# Altium schematic sheet 41. FPC Camera.SchDoc: CSI FPC CAMERA CONNECTORS
size 513 x 386 mm; Project: PROC154E2(001)_SK_AM69; Issue: 1.0; RevCode: E3; Page Create Date: March  8, 1995; Variant Name: Core Design; Schematic Page Number: 41; Page Number: 41; Page Size: C; Comment: MISTRAL_TITLEBLK_CSIZE_1; Page Count: 62; Schematic Page Count: 62; Name: PROC154E2 001 SK AM69; DsnPath: C:\Users\danie\Downloads\sprr466c\PROC154E3_RP\PROC154E3_SCH.DSN; SchematicName: SCHEMATIC1; PageName: 41. FPC Camera; PageSize: C; TopSchematic: True
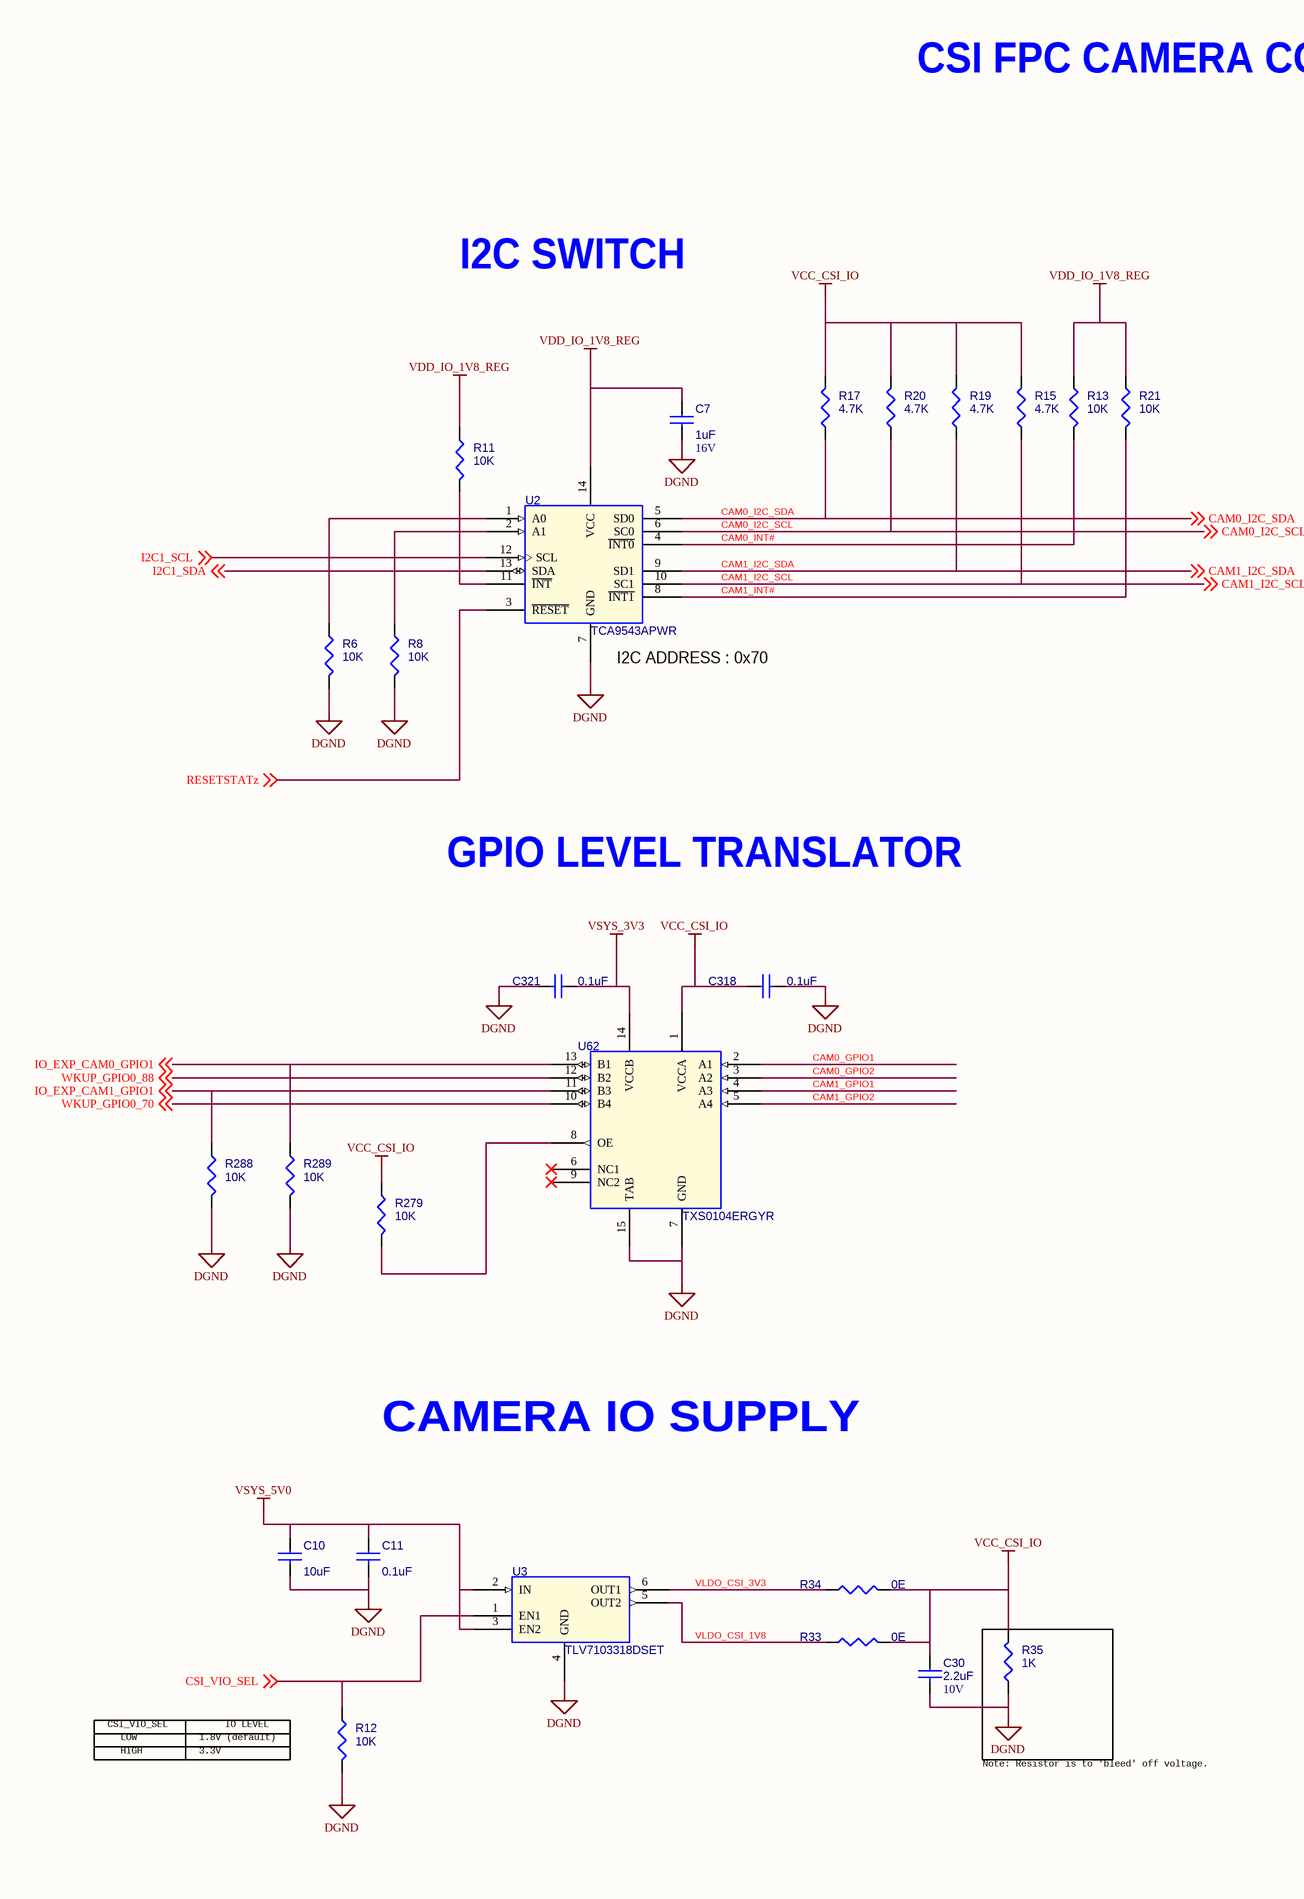
[diagram p0: 41. FPC Camera.SchDoc, left]
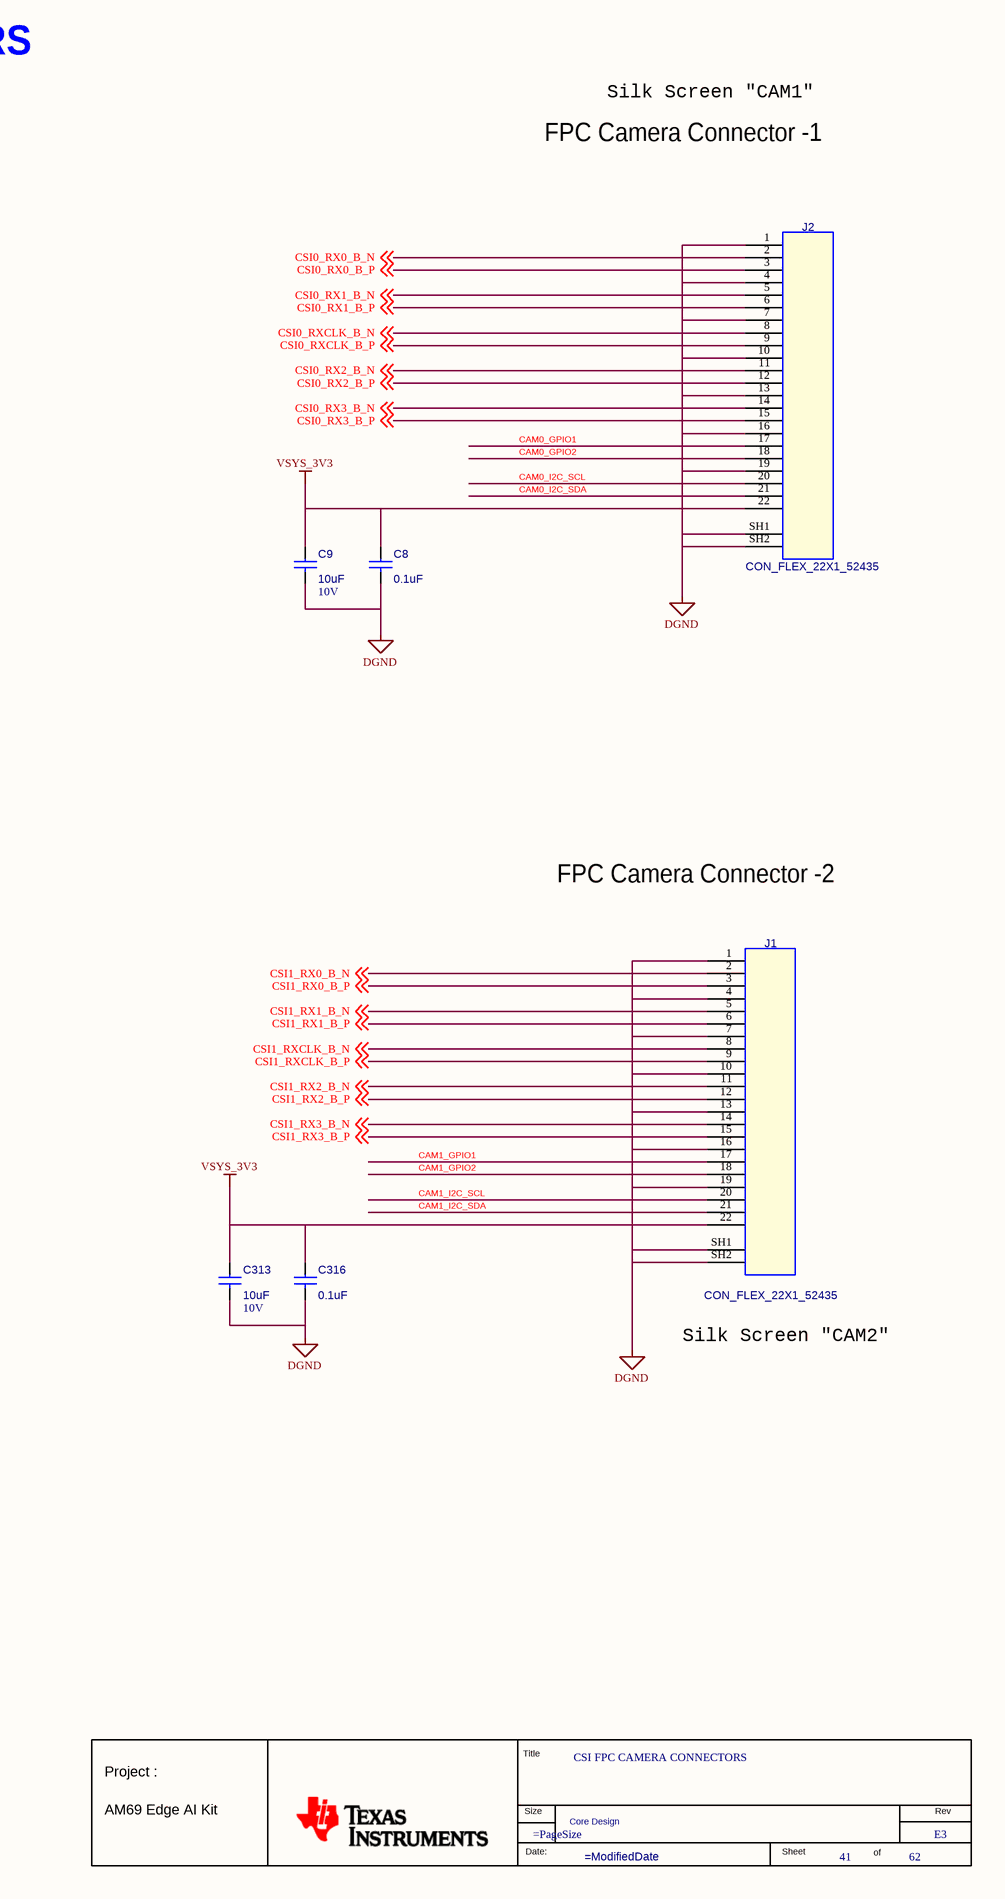
[diagram p1: 41. FPC Camera.SchDoc, right]

## Parts
*  RevCode: E3  Title: CSI FPC CAMERA CONNECTORS  Page Number: 41  Page Count: 62  Variant Name: Core Design  (hidden comment: MISTRAL_TITLEBLK_CSIZE_1)  (graphical)
C7  1uF  Voltage: 16V  [CAP0201_0-5]
C8  0.1uF  [CAP0201_0-5]
C9  10uF  Voltage: 10V  [CAP0402_1]
C10  10uF  [CAP0603_1]
C11  0.1uF  [CAP0201_0-5]
C30  2.2uF  Voltage: 10V  [CAP0603_1]
C313  10uF  Voltage: 10V  [CAP0402_1]
C316  0.1uF  [CAP0201_0-5]
C318  0.1uF  [CAP0201_0-5]
C321  0.1uF  [CAP0201_0-5]
J1  CON_FLEX_22X1_52435  [CON_FLEX22X1_52435_S_R_S]
J2  CON_FLEX_22X1_52435  [CON_FLEX22X1_52435_S_R_S]
R6  10K  [RES0201_0-5]
R8  10K  [RES0201_0-5]
R11  10K  [RES0201_0-5]
R12  10K  [RES0201_0-5]
R13  10K  [RES0201_0-5]
R15  4.7K  [RES0201_0-5]
R17  4.7K  [RES0201_0-5]
R19  4.7K  [RES0201_0-5]
R20  4.7K  [RES0201_0-5]
R21  10K  [RES0201_0-5]
R33  0E  [RES0402_0-5]
R34  0E  [RES0402_0-5]
R35  1K  [RES0201_0-5]
R279  10K  [RES0201_0-5]
R288  10K  [RES0201_0-5]
R289  10K  [RES0201_0-5]
U2  TCA9543APWR  [TSSOP14_25-59_205X180]
U3  TLV7103318DSET  [WSON6_19-68_60X60]
U62  TXS0104ERGYR  [QFN14_19-68_145X145]

## Nets
DGND: C7.2 C8.2 C9.2 C10.2 C11.2 C30.2 C313.2 C316.2 C318.2 C321.2 J1.1 J1.4 J1.7 J1.10 J1.13 J1.16 J1.19 J1.SH1 J1.SH2 J2.1 J2.4 J2.7 J2.10 J2.13 J2.16 J2.19 J2.SH1 J2.SH2 R6.2 R8.2 R12.2 R35.1 R288.2 R289.2 U2.7(GND) U3.4(GND) U62.7(GND) U62.15(TAB)
VCC_CSI_IO: C30.1 C318.1 R15.2 R17.2 R19.2 R20.2 R33.2 R34.2 R35.2 R279.1 U62.1(VCCA)
VDD_IO_1V8_REG: C7.1 R11.1 R13.1 R21.1 U2.14(VCC)
VSYS_3V3: C8.1 C9.1 C313.1 C316.1 C321.1 J1.22 J2.22 U62.14(VCCB)
VSYS_5V0: C10.1 C11.1 U3.2(IN) U3.3(EN2)
CAM0_GPIO1: J2.17 U62.2(A1)
CAM0_GPIO2: J2.18 U62.3(A2)
CAM0_I2C_SCL: J2.20 R20.1 U2.6(SC0) ; off-sheet CAM0_I2C_SCL
CAM0_I2C_SDA: J2.21 R17.1 U2.5(SD0) ; off-sheet CAM0_I2C_SDA
CAM0_INT#: R13.2 U2.4(~{INT0})
CAM1_GPIO1: J1.17 U62.4(A3)
CAM1_GPIO2: J1.18 U62.5(A4)
CAM1_I2C_SCL: J1.20 R15.1 U2.10(SC1) ; off-sheet CAM1_I2C_SCL
CAM1_I2C_SDA: J1.21 R19.1 U2.9(SD1) ; off-sheet CAM1_I2C_SDA
CAM1_INT#: R21.2 U2.8(~{INT1})
CSI0_RX0_B_N: J2.2 ; off-sheet CSI0_RX0_B_N
CSI0_RX0_B_P: J2.3 ; off-sheet CSI0_RX0_B_P
CSI0_RX1_B_N: J2.5 ; off-sheet CSI0_RX1_B_N
CSI0_RX1_B_P: J2.6 ; off-sheet CSI0_RX1_B_P
CSI0_RX2_B_N: J2.11 ; off-sheet CSI0_RX2_B_N
CSI0_RX2_B_P: J2.12 ; off-sheet CSI0_RX2_B_P
CSI0_RX3_B_N: J2.14 ; off-sheet CSI0_RX3_B_N
CSI0_RX3_B_P: J2.15 ; off-sheet CSI0_RX3_B_P
CSI0_RXCLK_B_N: J2.8 ; off-sheet CSI0_RXCLK_B_N
CSI0_RXCLK_B_P: J2.9 ; off-sheet CSI0_RXCLK_B_P
CSI1_RX0_B_N: J1.2 ; off-sheet CSI1_RX0_B_N
CSI1_RX0_B_P: J1.3 ; off-sheet CSI1_RX0_B_P
CSI1_RX1_B_N: J1.5 ; off-sheet CSI1_RX1_B_N
CSI1_RX1_B_P: J1.6 ; off-sheet CSI1_RX1_B_P
CSI1_RX2_B_N: J1.11 ; off-sheet CSI1_RX2_B_N
CSI1_RX2_B_P: J1.12 ; off-sheet CSI1_RX2_B_P
CSI1_RX3_B_N: J1.14 ; off-sheet CSI1_RX3_B_N
CSI1_RX3_B_P: J1.15 ; off-sheet CSI1_RX3_B_P
CSI1_RXCLK_B_N: J1.8 ; off-sheet CSI1_RXCLK_B_N
CSI1_RXCLK_B_P: J1.9 ; off-sheet CSI1_RXCLK_B_P
CSI_VIO_SEL: R12.1 U3.1(EN1) ; off-sheet CSI_VIO_SEL
I2C1_SCL: U2.12(SCL) ; off-sheet I2C1_SCL
I2C1_SDA: U2.13(SDA) ; off-sheet I2C1_SDA
IO_EXP_CAM0_GPIO1: R289.1 U62.13(B1) ; off-sheet IO_EXP_CAM0_GPIO1
IO_EXP_CAM1_GPIO1: R288.1 U62.11(B3) ; off-sheet IO_EXP_CAM1_GPIO1
RESETSTATz: U2.3(~{RESET}) ; off-sheet RESETSTATz
VLDO_CSI_1V8: R33.1 U3.5(OUT2)
VLDO_CSI_3V3: R34.1 U3.6(OUT1)
WKUP_GPIO0_70: U62.10(B4) ; off-sheet WKUP_GPIO0_70
WKUP_GPIO0_88: U62.12(B2) ; off-sheet WKUP_GPIO0_88
NetR6_1: R6.1 U2.1(A0)
NetR8_1: R8.1 U2.2(A1)
NetR11_2: R11.2 U2.11(~{INT})
NetR279_2: R279.2 U62.8(OE)

Not connected (* = marked no-connect by the designer): U62 6(NC1)* 9(NC2)*

## Notes on the sheet
- CSI FPC CAMERA CONNECTORS
- FPC Camera Connector -1
- Silk Screen "CAM1"
- I2C SWITCH
- (near U2) I2C ADDRESS : 0x70
- GPIO LEVEL TRANSLATOR
- FPC Camera Connector -2
- CAMERA IO SUPPLY
- Silk Screen "CAM2"
- CSI_VIO_SEL
- IO LEVEL
- LOW
- HIGH
- 1.8V (default)
- 3.3V
- Note: Resistor is to 'bleed' off voltage.
- (in symbol MISTRAL_TITLEBLK_CSIZE_1) Title; Project :; Size; Rev; AM69 Edge AI Kit; Date:; Sheet; of

## Library data of the parts
* = MISTRAL_TITLEBLK_CSIZE_1: Issue: 1.0; Project: PROC154E2(001)_SK_AM69; Name: PROC154E2 001 SK AM69; Page Create Date: March  8, 1995; Page Size: =PageSize; Page Modify Date: =ModifiedDate; Schematic Page Count: 62; Schematic Page Number: 41
C7 = CAP_Dup1: CAP CERAMIC 1uF 16V 20% X5R 0201; Part Reference: C7; Part_type: CAPACITORS\CERAMIC; Mfr_part_number: CL03A105MO3NRNH; Mfr_name: SAMSUNG; Mistral Part No: 120018090038-R; Custom_Duty: 15%; Customs_HS_Code: 85322990; Wattage: NA; Project: TI_60GHz-AOP; Value: 1uF; MECHANICAL 3D STEP FILE: CAP0201_0-5; Library Ref: CAP; Chkd/date: MANIRAJA/220918; Crtd /date: MANIRAJA/220918; Datasheet: Y:\MIS_DATABASE\DATASHEETS\CAPACITORS\CL03A105MO3NRNH.PDF; Temperature: -55°C+85°C; Weight: 0.17mg; Height: 0.39MM; Distributor_part_number: 1276-6798-1-ND; Distributor_name: DIGIKEY; Package: 0201; Tolerance: 20%; Footprint Ref: CAP0201_0-5; Library Path: Y:\MIS_DATABASE\Library\ALTIUM_TOOL\SCHEMATICS_PARTS\MS_DISCRETE_Library.schlib; Footprint Path: Y:\MIS_DATABASE\Library\ALTIUM_TOOL\PCB_FOOTPRINTS\Altium_Footprint_Lib.PcbLib; PCB Footprint: CAP0201_0-5
C8 = CAP_Dup1: CAP CERAMIC 0.1uF 16V 10% X7S AUTO 0201; Part Reference: C8; Part_type: CAPACITORS\CERAMIC; Mfr_part_number: GRT033C71C104KE01D; Mfr_name: MURATA; Mistral Part No: 120021030007-R; Custom_Duty: 15%; Customs_HS_Code: 85322990; Wattage: NA; Project: J7ES_SK_BRD; Value: 0.1uF; PCB Footprint: CAP0201_0-5; MECHANICAL 3D STEP FILE: CAP0201_0-5; Chkd/date: MANIRAJA/110321; Crtd /date: ALVY/110321; Datasheet: Y:\MIS_DATABASE\DATASHEETS\CAPACITORS\GRT033C71C104KE01.PDF; Temperature: -55°C+125°C; Weight: 330mg; Height: 0.33MM; Distributor_part_number: 490-GRT033C71C104KE01DTR-ND; Distributor_name: DIGIKEY; Package: 0201; Voltage: 16V; Tolerance: 10%
C9 = CAP_Dup1: CAP CERAMIC 10uF 10V 20% X5R 0402; Part Reference: C9; Mistral Part No: 120019020008-R; Mfr_name: SAMSUNG; Mfr_part_number: CL05A106MP8NUB8; Part_type: CAPACITORS\CERAMIC; Project: TI_60GHz-AOP; Wattage: NA; Customs_HS_Code: 85322990; Custom_Duty: 15%; Value: 10uF; PCB Footprint: CAP0402_1; Footprint Path: Y:\MIS_DATABASE\Library\ALTIUM_TOOL\PCB_FOOTPRINTS\Altium_Footprint_Lib.PcbLib; Library Path: Y:\MIS_DATABASE\Library\ALTIUM_TOOL\SCHEMATICS_PARTS\MS_DISCRETE_Library.schlib; Footprint Ref: CAP0402_1; Tolerance: 20%; Package: 0402; Distributor_name: DIGIKEY; Distributor_part_number: 1276-6830-1-ND; Height: 0.90MM; Weight: NA; Temperature: -55°C+85°C; Datasheet: Y:\MIS_DATABASE\DATASHEETS\CAPACITORS\CL05A106MP8NUB8.PDF; Crtd /date: ALVY/150219; Chkd/date: MANIRAJA/150219; Library Ref: CAP; MECHANICAL 3D STEP FILE: CAP0402_1
C10 = CAP_Dup1: CAP CERAMIC 10uF 16V 20% X6S 0603; Part Reference: C10; Part_type: CAPACITORS\CERAMIC; Mfr_part_number: EMK107BC6106MA-T; Mfr_name: TAIYO YUDEN; Mistral Part No: 120022090023-R; Custom_Duty: 15%; Customs_HS_Code: 85322990; Wattage: NA; Project: J7AHP_SK_BRD; Value: 10uF; PCB Footprint: CAP0603_1; Footprint Path: Y:\MIS_DATABASE\Library\ALTIUM_TOOL\PCB_FOOTPRINTS\Altium_Footprint_Lib.PcbLib; Library Path: Y:\MIS_DATABASE\Library\ALTIUM_TOOL\SCHEMATICS_PARTS\MS_DISCRETE_Library.schlib; MECHANICAL 3D STEP FILE: CAP0603_1; Chkd/date: PRAVEEN/160922; Crtd /date: PRAVEEN/160922; Datasheet: Y:\MIS_DATABASE\DATASHEETS\CAPACITORS\EMK107BC6106MA-T.PDF; Temperature: -55°C+105°C; Weight: NA; Height: 1.00MM; Library Ref: CAP; Distributor_part_number: 587-4867-1-ND; Distributor_name: DIGIKEY; Package: 0603; Voltage: 16V; Tolerance: 20%; Footprint Ref: CAP0603_1
C11 = CAP_Dup1: CAP CERAMIC 0.1uF 16V 10% X7S AUTO 0201; Part Reference: C11; Mistral Part No: 120021030007-R; Mfr_name: MURATA; Mfr_part_number: GRT033C71C104KE01D; Part_type: CAPACITORS\CERAMIC; Project: J7ES_SK_BRD; Wattage: NA; Customs_HS_Code: 85322990; Custom_Duty: 15%; Value: 0.1uF; Tolerance: 10%; Voltage: 16V; Package: 0201; Distributor_name: DIGIKEY; Distributor_part_number: 490-GRT033C71C104KE01DTR-ND; Height: 0.33MM; Weight: 330mg; Temperature: -55°C+125°C; Datasheet: Y:\MIS_DATABASE\DATASHEETS\CAPACITORS\GRT033C71C104KE01.PDF; Crtd /date: ALVY/110321; Chkd/date: MANIRAJA/110321; MECHANICAL 3D STEP FILE: CAP0201_0-5; PCB Footprint: CAP0201_0-5
C30 = CAP_Dup1: CAP CERAMIC 2.2uF 10V 10% X7S 0603; Part Reference: C30; Part_type: CAPACITORS\CERAMIC; Mfr_part_number: GCM188C71A225KE01; Mfr_name: MURATA; Mistral Part No: 120022090022-R; Custom_Duty: 15%; Customs_HS_Code: 85322990; Wattage: NA; Project: J7AHP_SK_BRD; Value: 2.2uF; Footprint Path: Y:\MIS_DATABASE\Library\ALTIUM_TOOL\PCB_FOOTPRINTS\Altium_Footprint_Lib.PcbLib; Library Path: Y:\MIS_DATABASE\Library\ALTIUM_TOOL\SCHEMATICS_PARTS\MS_DISCRETE_Library.schlib; MECHANICAL 3D STEP FILE: CAP0603_1; Footprint Ref: CAP0603_1; Library Ref: CAP; Chkd/date: PRAVEEN/160922; Crtd /date: PRAVEEN/160922; Datasheet: Y:\MIS_DATABASE\DATASHEETS\CAPACITORS\GCM188C71A225KE01.PDF; Temperature: -55°C+125°C; Weight: 6.3mg; Height: 0.90MM; Distributor_part_number: NA; Distributor_name: NA; Package: 0603; Tolerance: 10%; PCB Footprint: CAP0603_1
C313 = CAP_Dup1: CAP CERAMIC 10uF 10V 20% X5R 0402; Part Reference: C313; Mistral Part No: 120019020008-R; Mfr_name: SAMSUNG; Mfr_part_number: CL05A106MP8NUB8; Part_type: CAPACITORS\CERAMIC; Project: TI_60GHz-AOP; Wattage: NA; Customs_HS_Code: 85322990; Custom_Duty: 15%; Value: 10uF; PCB Footprint: CAP0402_1; Footprint Path: Y:\MIS_DATABASE\Library\ALTIUM_TOOL\PCB_FOOTPRINTS\Altium_Footprint_Lib.PcbLib; Library Path: Y:\MIS_DATABASE\Library\ALTIUM_TOOL\SCHEMATICS_PARTS\MS_DISCRETE_Library.schlib; Footprint Ref: CAP0402_1; Tolerance: 20%; Package: 0402; Distributor_name: DIGIKEY; Distributor_part_number: 1276-6830-1-ND; Height: 0.90MM; Weight: NA; Temperature: -55°C+85°C; Datasheet: Y:\MIS_DATABASE\DATASHEETS\CAPACITORS\CL05A106MP8NUB8.PDF; Crtd /date: ALVY/150219; Chkd/date: MANIRAJA/150219; Library Ref: CAP; MECHANICAL 3D STEP FILE: CAP0402_1
C316 = CAP_Dup1: CAP CERAMIC 0.1uF 16V 10% X7S AUTO 0201; Part Reference: C316; Part_type: CAPACITORS\CERAMIC; Mfr_part_number: GRT033C71C104KE01D; Mfr_name: MURATA; Mistral Part No: 120021030007-R; Custom_Duty: 15%; Customs_HS_Code: 85322990; Wattage: NA; Project: J7ES_SK_BRD; Value: 0.1uF; PCB Footprint: CAP0201_0-5; MECHANICAL 3D STEP FILE: CAP0201_0-5; Chkd/date: MANIRAJA/110321; Crtd /date: ALVY/110321; Datasheet: Y:\MIS_DATABASE\DATASHEETS\CAPACITORS\GRT033C71C104KE01.PDF; Temperature: -55°C+125°C; Weight: 330mg; Height: 0.33MM; Distributor_part_number: 490-GRT033C71C104KE01DTR-ND; Distributor_name: DIGIKEY; Package: 0201; Voltage: 16V; Tolerance: 10%
C318 = CAP_Dup1: CAP CERAMIC 0.1uF 16V 10% X7S AUTO 0201; Part Reference: C318; Part_type: CAPACITORS\CERAMIC; Mfr_part_number: GRT033C71C104KE01D; Mfr_name: MURATA; Mistral Part No: 120021030007-R; Custom_Duty: 15%; Customs_HS_Code: 85322990; Wattage: NA; Project: J7ES_SK_BRD; Value: 0.1uF; MECHANICAL 3D STEP FILE: CAP0201_0-5; Chkd/date: MANIRAJA/110321; Crtd /date: ALVY/110321; Datasheet: Y:\MIS_DATABASE\DATASHEETS\CAPACITORS\GRT033C71C104KE01.PDF; Temperature: -55°C+125°C; Weight: 330mg; Height: 0.33MM; Distributor_part_number: 490-GRT033C71C104KE01DTR-ND; Distributor_name: DIGIKEY; Package: 0201; Voltage: 16V; Tolerance: 10%; PCB Footprint: CAP0201_0-5
C321 = CAP_Dup1: CAP CERAMIC 0.1uF 16V 10% X7S AUTO 0201; Part Reference: C321; Part_type: CAPACITORS\CERAMIC; Mfr_part_number: GRT033C71C104KE01D; Mfr_name: MURATA; Mistral Part No: 120021030007-R; Custom_Duty: 15%; Customs_HS_Code: 85322990; Wattage: NA; Project: J7ES_SK_BRD; Value: 0.1uF; MECHANICAL 3D STEP FILE: CAP0201_0-5; Chkd/date: MANIRAJA/110321; Crtd /date: ALVY/110321; Datasheet: Y:\MIS_DATABASE\DATASHEETS\CAPACITORS\GRT033C71C104KE01.PDF; Temperature: -55°C+125°C; Weight: 330mg; Height: 0.33MM; Distributor_part_number: 490-GRT033C71C104KE01DTR-ND; Distributor_name: DIGIKEY; Package: 0201; Voltage: 16V; Tolerance: 10%; PCB Footprint: CAP0201_0-5
J1 = CON_22X1_2SH: CON FPC 22X1 0.50MM PITCH TPM RT SMD; Part Reference: J1; Mistral Part No: 150022080019-R; Mfr_name: MOLEX; Mfr_part_number: 52435-2271; Part_type: CONNECTOR\FPC; Project: JHAHP_SVB; Tolerance: NA; Customs_HS_Code: 85369090; Custom_Duty: 24%; Value: CON_FLEX_22X1_52435; PCB Footprint: CON_FLEX22X1_52435_S_R_S; Voltage: NA; Wattage: NA; Package: SMD; Distributor_name: DIGIKEY; Distributor_part_number: WM6753CT-ND; Library Ref: CON_22X1_2SH; Height: 2.00MM; Temperature: -20°C to +85°C; Datasheet: Y:\MIS_DATABASE\DATASHEETS\CONNECTORS\52435.PDF; Crtd /date: PRAVEEN/090822; Chkd/date: PRAVEEN/090822
J2 = CON_22X1_2SH: CON FPC 22X1 0.50MM PITCH TPM RT SMD; Part Reference: J2; Mistral Part No: 150022080019-R; Mfr_name: MOLEX; Mfr_part_number: 52435-2271; Part_type: CONNECTOR\FPC; Project: JHAHP_SVB; Tolerance: NA; Customs_HS_Code: 85369090; Custom_Duty: 24%; Value: CON_FLEX_22X1_52435; PCB Footprint: CON_FLEX22X1_52435_S_R_S; Voltage: NA; Wattage: NA; Package: SMD; Distributor_name: DIGIKEY; Distributor_part_number: WM6753CT-ND; Library Ref: CON_22X1_2SH; Height: 2.00MM; Temperature: -20°C to +85°C; Datasheet: Y:\MIS_DATABASE\DATASHEETS\CONNECTORS\52435.PDF; Crtd /date: PRAVEEN/090822; Chkd/date: PRAVEEN/090822
R6 = RESISTOR_Dup2: RES 10K 1/20W 5% 0201; Part Reference: R6; Mistral Part No: 110010070051-R; Mfr_name: YAGEO AMERICA; Mfr_part_number: RC0201JR-0710KL; Part_type: RESISTORS\FIXED; Project: GOLDEN-I LITE; Voltage: NA; Customs_HS_Code: 85332119; Custom_Duty: 15%; Value: 10K; Footprint Ref: RES0201_0-5; Tolerance: 5%; Wattage: 1/20W; Package: 0201; Distributor_name: DIGIKEY; Distributor_part_number: 311-10KNCT-ND; Library Ref: RESISTOR; Height: 0.26MM; Weight: 0.17mg; Temperature: -55°C+125°C; Datasheet: Y:\MIS_DATABASE\DATASHEETS\RESISTORS\RCXXXXL-SER_MAR18.PDF; Crtd /date: MANIRAJA/050517; Chkd/date: MANIRAJA/050517; MECHANICAL 3D STEP FILE: RES0201_0-5; Library Path: Y:\MIS_DATABASE\Library\ALTIUM_TOOL\SCHEMATICS_PARTS\MS_DISCRETE_Library.schlib; Footprint Path: Y:\MIS_DATABASE\Library\ALTIUM_TOOL\PCB_FOOTPRINTS\Altium_Footprint_Lib.PcbLib; PCB Footprint: RES0201_0-5
R8 = RESISTOR_Dup2: RES 10K 1/20W 5% 0201; Part Reference: R8; Mistral Part No: 110010070051-R; Mfr_name: YAGEO AMERICA; Mfr_part_number: RC0201JR-0710KL; Part_type: RESISTORS\FIXED; Project: GOLDEN-I LITE; Voltage: NA; Customs_HS_Code: 85332119; Custom_Duty: 15%; Value: 10K; Footprint Ref: RES0201_0-5; Tolerance: 5%; Wattage: 1/20W; Package: 0201; Distributor_name: DIGIKEY; Distributor_part_number: 311-10KNCT-ND; Library Ref: RESISTOR; Height: 0.26MM; Weight: 0.17mg; Temperature: -55°C+125°C; Datasheet: Y:\MIS_DATABASE\DATASHEETS\RESISTORS\RCXXXXL-SER_MAR18.PDF; Crtd /date: MANIRAJA/050517; Chkd/date: MANIRAJA/050517; MECHANICAL 3D STEP FILE: RES0201_0-5; Library Path: Y:\MIS_DATABASE\Library\ALTIUM_TOOL\SCHEMATICS_PARTS\MS_DISCRETE_Library.schlib; Footprint Path: Y:\MIS_DATABASE\Library\ALTIUM_TOOL\PCB_FOOTPRINTS\Altium_Footprint_Lib.PcbLib; PCB Footprint: RES0201_0-5
R11 = RESISTOR_Dup2: RES 10K 1/20W 5% 0201; Part Reference: R11; Mistral Part No: 110010070051-R; Mfr_name: YAGEO AMERICA; Mfr_part_number: RC0201JR-0710KL; Part_type: RESISTORS\FIXED; Project: GOLDEN-I LITE; Voltage: NA; Customs_HS_Code: 85332119; Custom_Duty: 15%; Value: 10K; Footprint Ref: RES0201_0-5; Tolerance: 5%; Wattage: 1/20W; Package: 0201; Distributor_name: DIGIKEY; Distributor_part_number: 311-10KNCT-ND; Library Ref: RESISTOR; Height: 0.26MM; Weight: 0.17mg; Temperature: -55°C+125°C; Datasheet: Y:\MIS_DATABASE\DATASHEETS\RESISTORS\RCXXXXL-SER_MAR18.PDF; Crtd /date: MANIRAJA/050517; Chkd/date: MANIRAJA/050517; MECHANICAL 3D STEP FILE: RES0201_0-5; Library Path: Y:\MIS_DATABASE\Library\ALTIUM_TOOL\SCHEMATICS_PARTS\MS_DISCRETE_Library.schlib; Footprint Path: Y:\MIS_DATABASE\Library\ALTIUM_TOOL\PCB_FOOTPRINTS\Altium_Footprint_Lib.PcbLib; PCB Footprint: RES0201_0-5
R12 = RESISTOR_Dup2: RES 10K 1/20W 5% 0201; Part Reference: R12; Mistral Part No: 110010070051-R; Mfr_name: YAGEO AMERICA; Mfr_part_number: RC0201JR-0710KL; Part_type: RESISTORS\FIXED; Project: GOLDEN-I LITE; Voltage: NA; Customs_HS_Code: 85332119; Custom_Duty: 15%; Value: 10K; Footprint Ref: RES0201_0-5; Tolerance: 5%; Wattage: 1/20W; Package: 0201; Distributor_name: DIGIKEY; Distributor_part_number: 311-10KNCT-ND; Library Ref: RESISTOR; Height: 0.26MM; Weight: 0.17mg; Temperature: -55°C+125°C; Datasheet: Y:\MIS_DATABASE\DATASHEETS\RESISTORS\RCXXXXL-SER_MAR18.PDF; Crtd /date: MANIRAJA/050517; Chkd/date: MANIRAJA/050517; MECHANICAL 3D STEP FILE: RES0201_0-5; Library Path: Y:\MIS_DATABASE\Library\ALTIUM_TOOL\SCHEMATICS_PARTS\MS_DISCRETE_Library.schlib; Footprint Path: Y:\MIS_DATABASE\Library\ALTIUM_TOOL\PCB_FOOTPRINTS\Altium_Footprint_Lib.PcbLib; PCB Footprint: RES0201_0-5
R13 = RESISTOR_Dup2: RES 10K 1/20W 5% 0201; Part Reference: R13; Mistral Part No: 110010070051-R; Mfr_name: YAGEO AMERICA; Mfr_part_number: RC0201JR-0710KL; Part_type: RESISTORS\FIXED; Project: GOLDEN-I LITE; Voltage: NA; Customs_HS_Code: 85332119; Custom_Duty: 15%; Value: 10K; Footprint Ref: RES0201_0-5; Tolerance: 5%; Wattage: 1/20W; Package: 0201; Distributor_name: DIGIKEY; Distributor_part_number: 311-10KNCT-ND; Library Ref: RESISTOR; Height: 0.26MM; Weight: 0.17mg; Temperature: -55°C+125°C; Datasheet: Y:\MIS_DATABASE\DATASHEETS\RESISTORS\RCXXXXL-SER_MAR18.PDF; Crtd /date: MANIRAJA/050517; Chkd/date: MANIRAJA/050517; MECHANICAL 3D STEP FILE: RES0201_0-5; Library Path: Y:\MIS_DATABASE\Library\ALTIUM_TOOL\SCHEMATICS_PARTS\MS_DISCRETE_Library.schlib; Footprint Path: Y:\MIS_DATABASE\Library\ALTIUM_TOOL\PCB_FOOTPRINTS\Altium_Footprint_Lib.PcbLib; PCB Footprint: RES0201_0-5
R15 = RESISTOR_Dup2: RES 4.7K 1/20W 5% 0201; Part Reference: R15; Mistral Part No: 110010070061-R; Mfr_name: PANASONIC-ECG; Mfr_part_number: ERJ-1GNJ472C; Part_type: RESISTORS\FIXED; Project: CUSTOM DCA1000; Voltage: NA; Customs_HS_Code: 85332119; Custom_Duty: 15%; Value: 4.7K; Footprint Ref: RES0201_0-5; Tolerance: 5%; Wattage: 1/20W; Package: 0201; Distributor_name: DIGIKEY; Distributor_part_number: P4.7AECT-ND; Library Ref: RESISTOR; Height: 0.26MM; Weight: 0.15mg; Temperature: -55°C+125°C; Datasheet: Y:\MIS_DATABASE\DATASHEETS\RESISTORS\PAN-ERJSER_NOV17.PDF; Crtd /date: ALVY/170420; Chkd/date: MANIRAJA/170420; MECHANICAL 3D STEP FILE: RES0201_0-5; Library Path: Y:\MIS_DATABASE\Library\ALTIUM_TOOL\SCHEMATICS_PARTS\MS_DISCRETE_Library.schlib; Footprint Path: Y:\MIS_DATABASE\Library\ALTIUM_TOOL\PCB_FOOTPRINTS\Altium_Footprint_Lib.PcbLib; PCB Footprint: RES0201_0-5
R17 = RESISTOR_Dup2: RES 4.7K 1/20W 5% 0201; Part Reference: R17; Mistral Part No: 110010070061-R; Mfr_name: PANASONIC-ECG; Mfr_part_number: ERJ-1GNJ472C; Part_type: RESISTORS\FIXED; Project: CUSTOM DCA1000; Voltage: NA; Customs_HS_Code: 85332119; Custom_Duty: 15%; Value: 4.7K; Footprint Ref: RES0201_0-5; Tolerance: 5%; Wattage: 1/20W; Package: 0201; Distributor_name: DIGIKEY; Distributor_part_number: P4.7AECT-ND; Library Ref: RESISTOR; Height: 0.26MM; Weight: 0.15mg; Temperature: -55°C+125°C; Datasheet: Y:\MIS_DATABASE\DATASHEETS\RESISTORS\PAN-ERJSER_NOV17.PDF; Crtd /date: ALVY/170420; Chkd/date: MANIRAJA/170420; MECHANICAL 3D STEP FILE: RES0201_0-5; Library Path: Y:\MIS_DATABASE\Library\ALTIUM_TOOL\SCHEMATICS_PARTS\MS_DISCRETE_Library.schlib; Footprint Path: Y:\MIS_DATABASE\Library\ALTIUM_TOOL\PCB_FOOTPRINTS\Altium_Footprint_Lib.PcbLib; PCB Footprint: RES0201_0-5
R19 = RESISTOR_Dup2: RES 4.7K 1/20W 5% 0201; Part Reference: R19; Mistral Part No: 110010070061-R; Mfr_name: PANASONIC-ECG; Mfr_part_number: ERJ-1GNJ472C; Part_type: RESISTORS\FIXED; Project: CUSTOM DCA1000; Voltage: NA; Customs_HS_Code: 85332119; Custom_Duty: 15%; Value: 4.7K; Footprint Ref: RES0201_0-5; Tolerance: 5%; Wattage: 1/20W; Package: 0201; Distributor_name: DIGIKEY; Distributor_part_number: P4.7AECT-ND; Library Ref: RESISTOR; Height: 0.26MM; Weight: 0.15mg; Temperature: -55°C+125°C; Datasheet: Y:\MIS_DATABASE\DATASHEETS\RESISTORS\PAN-ERJSER_NOV17.PDF; Crtd /date: ALVY/170420; Chkd/date: MANIRAJA/170420; MECHANICAL 3D STEP FILE: RES0201_0-5; Library Path: Y:\MIS_DATABASE\Library\ALTIUM_TOOL\SCHEMATICS_PARTS\MS_DISCRETE_Library.schlib; Footprint Path: Y:\MIS_DATABASE\Library\ALTIUM_TOOL\PCB_FOOTPRINTS\Altium_Footprint_Lib.PcbLib; PCB Footprint: RES0201_0-5
R20 = RESISTOR_Dup2: RES 4.7K 1/20W 5% 0201; Part Reference: R20; Part_type: RESISTORS\FIXED; Mfr_part_number: ERJ-1GNJ472C; Mfr_name: PANASONIC-ECG; Mistral Part No: 110010070061-R; Custom_Duty: 15%; Customs_HS_Code: 85332119; Voltage: NA; Project: CUSTOM DCA1000; Value: 4.7K; Footprint Path: Y:\MIS_DATABASE\Library\ALTIUM_TOOL\PCB_FOOTPRINTS\Altium_Footprint_Lib.PcbLib; Library Path: Y:\MIS_DATABASE\Library\ALTIUM_TOOL\SCHEMATICS_PARTS\MS_DISCRETE_Library.schlib; MECHANICAL 3D STEP FILE: RES0201_0-5; Chkd/date: MANIRAJA/170420; Crtd /date: ALVY/170420; Datasheet: Y:\MIS_DATABASE\DATASHEETS\RESISTORS\PAN-ERJSER_NOV17.PDF; Temperature: -55°C+125°C; Weight: 0.15mg; Height: 0.26MM; Library Ref: RESISTOR; Distributor_part_number: P4.7AECT-ND; Distributor_name: DIGIKEY; Package: 0201; Wattage: 1/20W; Tolerance: 5%; Footprint Ref: RES0201_0-5; PCB Footprint: RES0201_0-5
R21 = RESISTOR_Dup2: RES 10K 1/20W 5% 0201; Part Reference: R21; Mistral Part No: 110010070051-R; Mfr_name: YAGEO AMERICA; Mfr_part_number: RC0201JR-0710KL; Part_type: RESISTORS\FIXED; Project: GOLDEN-I LITE; Voltage: NA; Customs_HS_Code: 85332119; Custom_Duty: 15%; Value: 10K; Footprint Ref: RES0201_0-5; Tolerance: 5%; Wattage: 1/20W; Package: 0201; Distributor_name: DIGIKEY; Distributor_part_number: 311-10KNCT-ND; Library Ref: RESISTOR; Height: 0.26MM; Weight: 0.17mg; Temperature: -55°C+125°C; Datasheet: Y:\MIS_DATABASE\DATASHEETS\RESISTORS\RCXXXXL-SER_MAR18.PDF; Crtd /date: MANIRAJA/050517; Chkd/date: MANIRAJA/050517; MECHANICAL 3D STEP FILE: RES0201_0-5; Library Path: Y:\MIS_DATABASE\Library\ALTIUM_TOOL\SCHEMATICS_PARTS\MS_DISCRETE_Library.schlib; Footprint Path: Y:\MIS_DATABASE\Library\ALTIUM_TOOL\PCB_FOOTPRINTS\Altium_Footprint_Lib.PcbLib; PCB Footprint: RES0201_0-5
R33 = RESISTOR_Dup2: RES 0E 1/10W JUMPER 0402; Part Reference: R33; Mistral Part No: 110018030052-R; Mfr_name: PANASONIC-ECG; Mfr_part_number: ERJ-2GE0R00X; Part_type: RESISTORS\FIXED; Project: AEGIS POM; Tolerance: NA; Customs_HS_Code: 85332119; Custom_Duty: 15%; Value: 0E; Footprint Path: Y:\MIS_DATABASE\Library\ALTIUM_TOOL\PCB_FOOTPRINTS\Altium_Footprint_Lib.PcbLib; Library Path: Y:\MIS_DATABASE\Library\ALTIUM_TOOL\SCHEMATICS_PARTS\MS_DISCRETE_Library.schlib; Voltage: NA; Wattage: 1/10W; Package: 0402; Distributor_name: DIGIKEY; Distributor_part_number: P0.0JCT-ND; Height: 0.40MM; Weight: 0.8mg; Temperature: -55°C+155°C; Datasheet: Y:\MIS_DATABASE\DATASHEETS\RESISTORS\PAN-ERJSER_NOV17.PDF; Crtd /date: NAVEED/201014; Chkd/date: VASANTHA/061216; MECHANICAL 3D STEP FILE: RES0402_0-5; Library Ref: RESISTOR; Footprint Ref: RES0402_0-5; PCB Footprint: RES0402_0-5
R34 = RESISTOR_Dup2: RES 0E 1/10W JUMPER 0402; Part Reference: R34; Part_type: RESISTORS\FIXED; Mfr_part_number: ERJ-2GE0R00X; Mfr_name: PANASONIC-ECG; Mistral Part No: 110018030052-R; Custom_Duty: 15%; Customs_HS_Code: 85332119; Voltage: NA; Project: AEGIS POM; Value: 0E; Footprint Ref: RES0402_0-5; Library Ref: RESISTOR; MECHANICAL 3D STEP FILE: RES0402_0-5; Chkd/date: VASANTHA/061216; Crtd /date: NAVEED/201014; Datasheet: Y:\MIS_DATABASE\DATASHEETS\RESISTORS\PAN-ERJSER_NOV17.PDF; Temperature: -55°C+155°C; Weight: 0.8mg; Height: 0.40MM; Distributor_part_number: P0.0JCT-ND; Distributor_name: DIGIKEY; Package: 0402; Wattage: 1/10W; Tolerance: NA; Library Path: Y:\MIS_DATABASE\Library\ALTIUM_TOOL\SCHEMATICS_PARTS\MS_DISCRETE_Library.schlib; Footprint Path: Y:\MIS_DATABASE\Library\ALTIUM_TOOL\PCB_FOOTPRINTS\Altium_Footprint_Lib.PcbLib; PCB Footprint: RES0402_0-5
R35 = RESISTOR_Dup2: RES 1K 1/20W 5% 0201; Part Reference: R35; Part_type: RESISTORS\FIXED; Mfr_part_number: RC0201JR-071KL; Mfr_name: YAGEO AMERICA; Mistral Part No: 110009030395-R; Voltage: NA; Project: GOLDEN-I LITE; Customs_HS_Code: 85332119; Custom_Duty: 15%; Value: 1K; Footprint Path: Y:\MIS_DATABASE\Library\ALTIUM_TOOL\PCB_FOOTPRINTS\Altium_Footprint_Lib.PcbLib; Crtd /date: MANIRAJA/050517; Datasheet: Y:\MIS_DATABASE\DATASHEETS\RESISTORS\RCXXXXL-SER_MAR18.PDF; Temperature: -55°C+125°C; Weight: 0.17mg; Height: 0.26MM; Distributor_part_number: 311-1KNCT-ND; Distributor_name: DIGIKEY; Package: 0201; Wattage: 1/20W; Tolerance: 5%; Library Ref: RESISTOR; Footprint Ref: RES0201_0-5; Chkd/date: MANIRAJA/050517; MECHANICAL 3D STEP FILE: RES0201_0-5; Library Path: Y:\MIS_DATABASE\Library\ALTIUM_TOOL\SCHEMATICS_PARTS\MS_DISCRETE_Library.schlib; PCB Footprint: RES0201_0-5
R279 = RESISTOR_Dup2: RES 10K 1/20W 5% 0201; Part Reference: R279; Part_type: RESISTORS\FIXED; Mfr_part_number: RC0201JR-0710KL; Mfr_name: YAGEO AMERICA; Mistral Part No: 110010070051-R; Custom_Duty: 15%; Customs_HS_Code: 85332119; Voltage: NA; Project: GOLDEN-I LITE; Value: 10K; Footprint Path: Y:\MIS_DATABASE\Library\ALTIUM_TOOL\PCB_FOOTPRINTS\Altium_Footprint_Lib.PcbLib; Library Path: Y:\MIS_DATABASE\Library\ALTIUM_TOOL\SCHEMATICS_PARTS\MS_DISCRETE_Library.schlib; MECHANICAL 3D STEP FILE: RES0201_0-5; Chkd/date: MANIRAJA/050517; Crtd /date: MANIRAJA/050517; Datasheet: Y:\MIS_DATABASE\DATASHEETS\RESISTORS\RCXXXXL-SER_MAR18.PDF; Temperature: -55°C+125°C; Weight: 0.17mg; Height: 0.26MM; Library Ref: RESISTOR; Distributor_part_number: 311-10KNCT-ND; Distributor_name: DIGIKEY; Package: 0201; Wattage: 1/20W; Tolerance: 5%; Footprint Ref: RES0201_0-5; PCB Footprint: RES0201_0-5
R288 = RESISTOR_Dup2: RES 10K 1/20W 5% 0201; Part Reference: R288; Part_type: RESISTORS\FIXED; Mfr_part_number: RC0201JR-0710KL; Mfr_name: YAGEO AMERICA; Mistral Part No: 110010070051-R; Custom_Duty: 15%; Customs_HS_Code: 85332119; Voltage: NA; Project: GOLDEN-I LITE; Value: 10K; Footprint Path: Y:\MIS_DATABASE\Library\ALTIUM_TOOL\PCB_FOOTPRINTS\Altium_Footprint_Lib.PcbLib; Library Path: Y:\MIS_DATABASE\Library\ALTIUM_TOOL\SCHEMATICS_PARTS\MS_DISCRETE_Library.schlib; MECHANICAL 3D STEP FILE: RES0201_0-5; Chkd/date: MANIRAJA/050517; Crtd /date: MANIRAJA/050517; Datasheet: Y:\MIS_DATABASE\DATASHEETS\RESISTORS\RCXXXXL-SER_MAR18.PDF; Temperature: -55°C+125°C; Weight: 0.17mg; Height: 0.26MM; Library Ref: RESISTOR; Distributor_part_number: 311-10KNCT-ND; Distributor_name: DIGIKEY; Package: 0201; Wattage: 1/20W; Tolerance: 5%; Footprint Ref: RES0201_0-5; PCB Footprint: RES0201_0-5
R289 = RESISTOR_Dup2: RES 10K 1/20W 5% 0201; Part Reference: R289; Part_type: RESISTORS\FIXED; Mfr_part_number: RC0201JR-0710KL; Mfr_name: YAGEO AMERICA; Mistral Part No: 110010070051-R; Custom_Duty: 15%; Customs_HS_Code: 85332119; Voltage: NA; Project: GOLDEN-I LITE; Value: 10K; Footprint Path: Y:\MIS_DATABASE\Library\ALTIUM_TOOL\PCB_FOOTPRINTS\Altium_Footprint_Lib.PcbLib; Library Path: Y:\MIS_DATABASE\Library\ALTIUM_TOOL\SCHEMATICS_PARTS\MS_DISCRETE_Library.schlib; MECHANICAL 3D STEP FILE: RES0201_0-5; Chkd/date: MANIRAJA/050517; Crtd /date: MANIRAJA/050517; Datasheet: Y:\MIS_DATABASE\DATASHEETS\RESISTORS\RCXXXXL-SER_MAR18.PDF; Temperature: -55°C+125°C; Weight: 0.17mg; Height: 0.26MM; Library Ref: RESISTOR; Distributor_part_number: 311-10KNCT-ND; Distributor_name: DIGIKEY; Package: 0201; Wattage: 1/20W; Tolerance: 5%; Footprint Ref: RES0201_0-5; PCB Footprint: RES0201_0-5
U2 = TCA9543APWR_TSSOP14: IC 2-CHANNEL I2C BUS SWITCH WITH RESET TSSOP14; Part Reference: U2; Part_type: ICS\DIGITAL\BUSTRANSCEIVER; Mfr_name: TEXAS INSTRUMENTS; Mistral Part No: 141016030006-R; Wattage: NA; Project: OCTASIC_3600; Value: TCA9543APWR; Footprint Path: Y:\MIS_DATABASE\Library\ALTIUM_TOOL\PCB_FOOTPRINTS\Altium_Footprint_Lib.PcbLib; Library Path: Y:\MIS_DATABASE\Library\ALTIUM_TOOL\SCHEMATICS_PARTS\MS_BUSDRIVERTRANSCEIVER_Library.schlib; Chkd/date: VASANTHA/060516; Crtd /date: VASANTHA/070316; Datasheet: Y:\MIS_DATABASE\DATASHEETS\ICS\DIGITAL\BUSTRANSCEIVER\TCA9543A.PDF; Temperature: -40°C+85°C; Weight: NA; Height: 1.20MM; Library Ref: TCA9543APWR_TSSOP14; Distributor_part_number: 296-42157-1-ND; Distributor_name: DIGIKEY; Package: TSSOP14; Voltage: NA; Tolerance: NA; Mfr_part_number: TCA9543APWR; Footprint Ref: TSSOP14_25-59_205X180_1-2; PCB Footprint: TSSOP14_25-59_205X180
U3 = TLV7103318D_WSON6: IC REGULATOR LDO LINEAR 200mA WSON6; Part Reference: U3; Mistral Part No: 142015030017-R; Mfr_name: TEXAS INSTRUMENTS; Part_type: ICS\POWER\VOLTAGE REGULATOR; Automotive Alternate_mfr_part_number: TLV7103318QDSERQ1; Project: DUET BOARDS; Tolerance: NA; Customs_HS_Code: 85423100; Custom_Duty: 15%; Value: TLV7103318DSET; Mfr_part_number: TLV7103318DSET; Voltage: NA; Wattage: NA; Package: WSON6; Distributor_name: DIGIKEY; Distributor_part_number: 296-29058-1-ND; Library Ref: TLV7103318D_WSON6; Height: 0.80MM; Weight: NA; Temperature: -40°C+125°C; Datasheet: Y:\MIS_DATABASE\DATASHEETS\MISC\REGULATORS\TLV71-SER.PDF; Crtd /date: JEBRAN/300315; Chkd/date: NAVEED/080415; Automotive Alternate_mfr_name: TEXAS INSTRUMENTS; PCB Footprint: WSON6_19-68_60X60
U62 = TXS0104ERGYR_QFN14: IC 4-BIT BIDIRECTIONAL VOLTAGE-LEVEL TRANSLATOR QFN14; Part Reference: U62; Part_type: ICS\INTERFACE; Mfr_name: TEXAS INSTRUMENTS; Mistral Part No: 141009030362-R; Custom_Duty: 15%; Customs_HS_Code: 85423100; Project: HS100RD; Value: TXS0104ERGYR; RoHS: Sb/ Br FREE; Chkd/date: SHREESHAIL/170108; Crtd /date: SHREESHAIL/170108; Datasheet: Y:\MIS_DATABASE\DATASHEETS\ICS\INTERFACE\TXS0104E.PDF; Height: 1.00MM; Library Ref: TXS0104ERGYR_QFN14; Distributor_part_number: 296-20698-1-ND; Distributor_name: DIGIKEY; Package: QFN14; Mfr_part_number: TXS0104ERGYR; PCB Footprint: QFN14_19-68_145X145